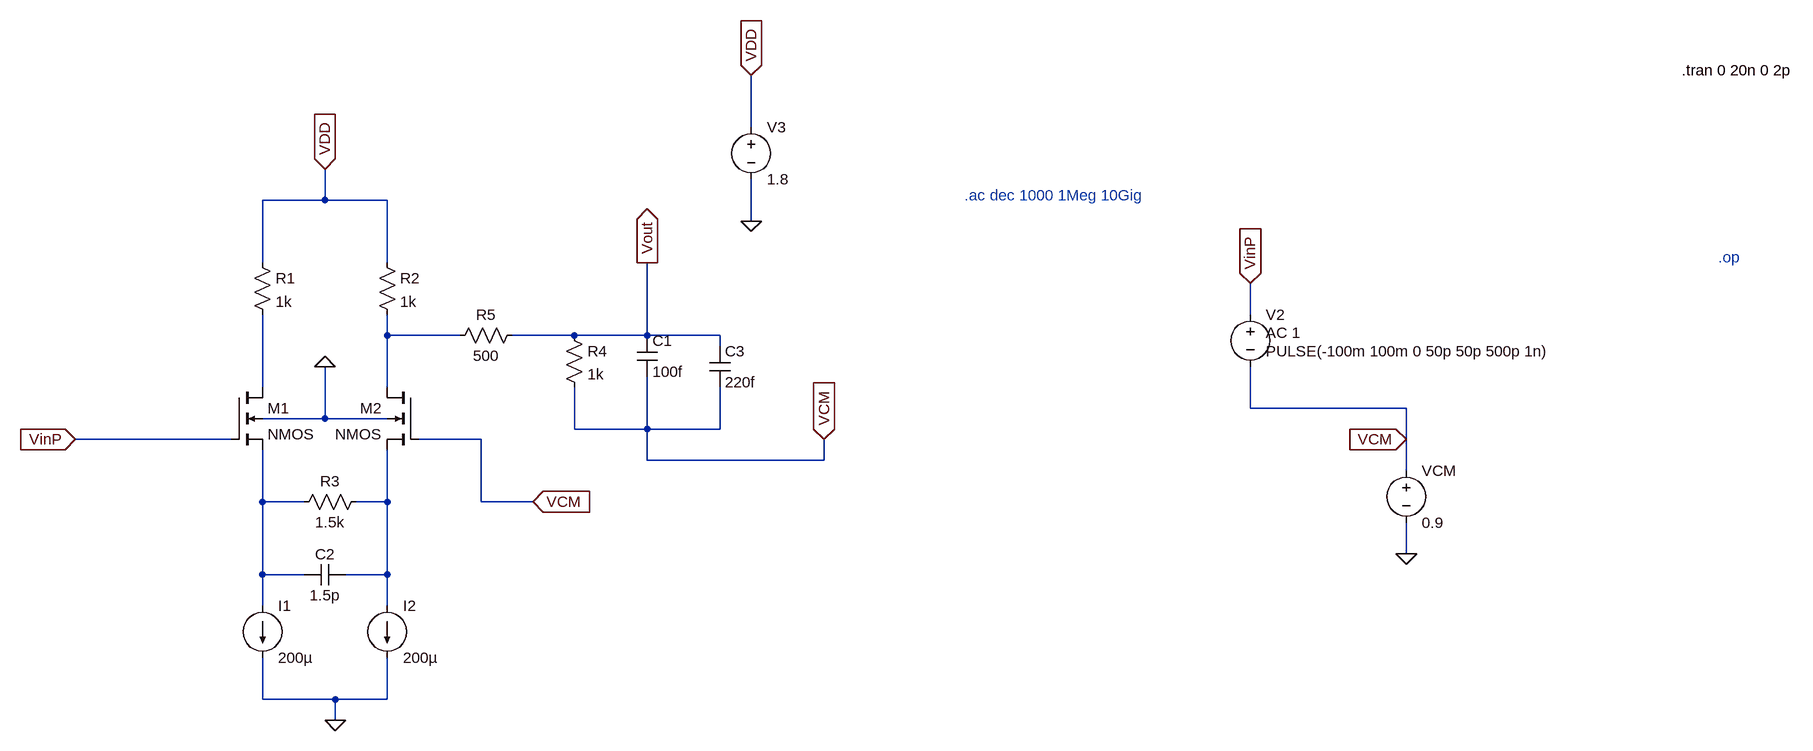
[diagram p0: schematic CTLE.asc]
CTLE.asc, the LTspice schematic file:
Version 4.1
SHEET 1 2112 772
WIRE 256 -208 256 -288
WIRE -400 -96 -400 -144
WIRE -400 -96 -496 -96
WIRE -304 -96 -400 -96
WIRE 256 -64 256 -128
WIRE -496 0 -496 -96
WIRE -304 0 -304 -96
WIRE 1024 80 1024 32
WIRE -304 112 -304 80
WIRE -192 112 -304 112
WIRE -16 112 -112 112
WIRE 96 112 96 0
WIRE 96 112 -16 112
WIRE 208 112 96 112
WIRE 208 128 208 112
WIRE -496 192 -496 80
WIRE -304 192 -304 112
WIRE 1024 224 1024 160
WIRE 1264 224 1024 224
WIRE -400 240 -400 160
WIRE -400 240 -496 240
WIRE -304 240 -400 240
WIRE -16 256 -16 192
WIRE 96 256 96 176
WIRE 96 256 -16 256
WIRE 208 256 208 192
WIRE 208 256 96 256
WIRE -544 272 -784 272
WIRE -160 272 -256 272
WIRE 1264 272 1264 224
WIRE 96 304 96 256
WIRE 368 304 368 272
WIRE 368 304 96 304
WIRE 1264 320 1264 272
WIRE -496 368 -496 288
WIRE -432 368 -496 368
WIRE -304 368 -304 288
WIRE -304 368 -352 368
WIRE -160 368 -160 272
WIRE -80 368 -160 368
WIRE 1264 448 1264 400
WIRE -496 480 -496 368
WIRE -432 480 -496 480
WIRE -304 480 -304 368
WIRE -304 480 -368 480
WIRE -496 528 -496 480
WIRE -304 528 -304 480
WIRE -496 672 -496 608
WIRE -384 672 -496 672
WIRE -304 672 -304 608
WIRE -304 672 -384 672
WIRE -384 704 -384 672
FLAG 1264 448 0
FLAG 1024 32 VinP
IOPIN 1024 32 In
FLAG 256 -288 VDD
IOPIN 256 -288 In
FLAG 256 -64 0
FLAG 96 0 Vout
IOPIN 96 0 Out
FLAG -400 -144 VDD
IOPIN -400 -144 In
FLAG -384 704 0
FLAG -80 368 VCM
IOPIN -80 368 In
FLAG -784 272 VinP
IOPIN -784 272 In
FLAG 1264 272 VCM
IOPIN 1264 272 In
FLAG 368 272 VCM
IOPIN 368 272 In
FLAG -400 160 0
SYMBOL res -512 -16 R0
SYMATTR InstName R1
SYMATTR Value 1k
SYMBOL res -320 -16 R0
SYMATTR InstName R2
SYMATTR Value 1k
SYMBOL res -336 352 R90
WINDOW 0 0 56 VBottom 2
WINDOW 3 32 56 VTop 2
SYMATTR InstName R3
SYMATTR Value 1.5k
SYMBOL cap -368 464 R90
WINDOW 0 0 32 VBottom 2
WINDOW 3 32 32 VTop 2
SYMATTR InstName C2
SYMATTR Value 1.5p
SYMBOL voltage 1264 304 R0
WINDOW 123 0 0 Left 0
WINDOW 39 0 0 Left 0
SYMATTR InstName VCM
SYMATTR Value 0.9
SYMBOL voltage 1024 64 R0
WINDOW 3 24 72 Left 2
WINDOW 123 24 44 Left 2
WINDOW 39 0 0 Left 0
SYMATTR InstName V2
SYMATTR Value PULSE(-100m 100m 0 50p 50p 500p 1n)
SYMATTR Value2 AC 1
SYMBOL voltage 256 -224 R0
WINDOW 123 0 0 Left 0
WINDOW 39 0 0 Left 0
SYMATTR InstName V3
SYMATTR Value 1.8
SYMBOL current -496 528 R0
WINDOW 123 0 0 Left 0
WINDOW 39 0 0 Left 0
SYMATTR InstName I1
SYMATTR Value 200µ
SYMBOL current -304 528 R0
WINDOW 123 0 0 Left 0
WINDOW 39 0 0 Left 0
SYMATTR InstName I2
SYMATTR Value 200µ
SYMBOL cap 80 112 R0
SYMATTR InstName C1
SYMATTR Value 100f
SYMBOL res -32 96 R0
SYMATTR InstName R4
SYMATTR Value 1k
SYMBOL nmos4 -544 192 R0
SYMATTR InstName M1
SYMATTR Value2 l=180n w=10u
SYMBOL nmos4 -256 192 M0
SYMATTR InstName M2
SYMATTR Value2 l=180n w=10u
SYMBOL cap 192 128 R0
SYMATTR InstName C3
SYMATTR Value 220f
SYMBOL res -96 96 R90
WINDOW 0 0 56 VBottom 2
WINDOW 3 32 56 VTop 2
SYMATTR InstName R5
SYMATTR Value 500
TEXT 584 -104 Left 2 ;.ac dec 1000 1Meg 10Gig
TEXT 1744 -8 Left 2 ;.op
TEXT 1688 -296 Left 2 !.tran 0 20n 0 2p

The netlist it stands for:
* CTLE.asc
R1 VDD N002 1k
R2 VDD N001 1k
R3 N004 N003 1.5k
C2 N004 N003 1.5p
VCM VCM 0 0.9
V2 VinP VCM PULSE(-100m 100m 0 50p 50p 500p 1n) AC 1
V3 VDD 0 1.8
I1 N003 0 200µ
I2 N004 0 200µ
C1 Vout VCM 100f
R4 Vout VCM 1k
M1 N002 VinP N003 0 NMOS l=180n w=10u
M2 N001 VCM N004 0 NMOS l=180n w=10u
C3 Vout VCM 220f
R5 Vout N001 500
.model NMOS NMOS
.model PMOS PMOS
.lib standard.mos
* .ac dec 1000 1Meg 10Gig
* .op
.tran 0 20n 0 2p
.backanno
.end